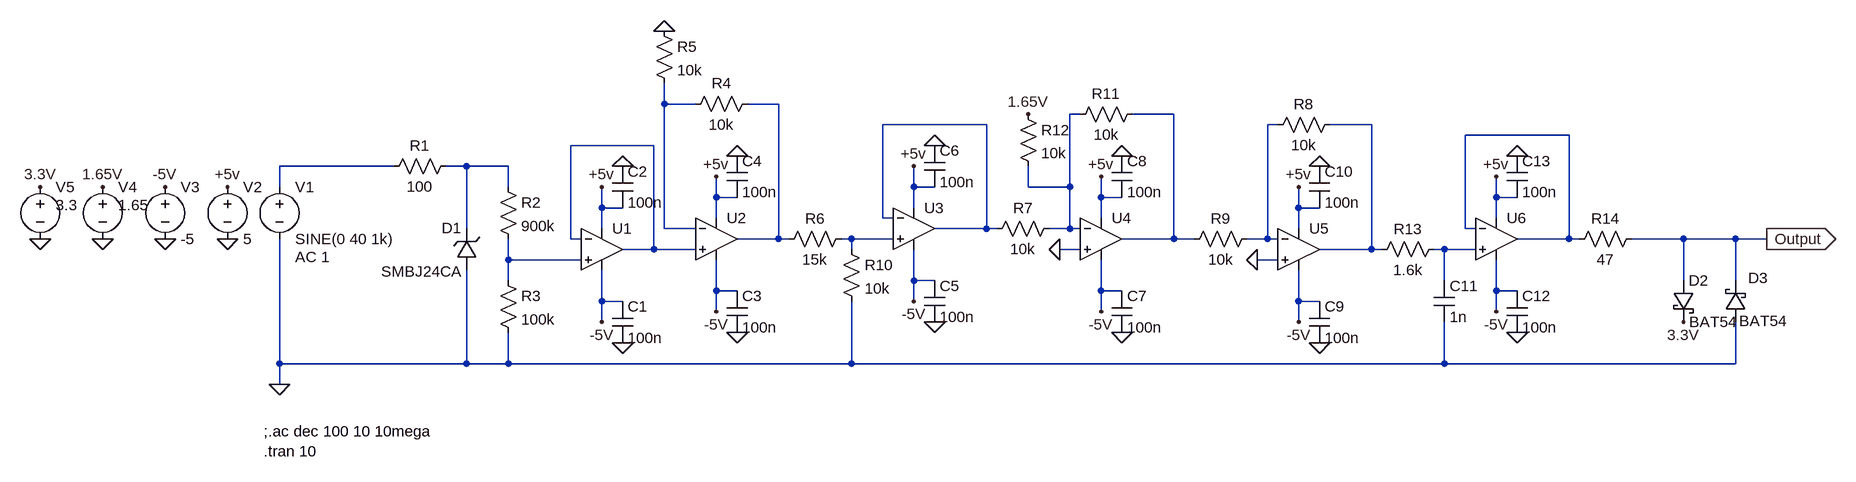
[diagram p0: schematic Osc_front.asc]
Osc_front.asc, the LTspice schematic file:
Version 4.1
SHEET 1 2380 712
WIRE 544 16 544 -16
WIRE 592 16 544 16
WIRE 720 16 672 16
WIRE 1184 32 1168 32
WIRE 1328 32 1264 32
WIRE 1040 48 880 48
WIRE 1488 48 1472 48
WIRE 1632 48 1568 48
WIRE 1936 64 1776 64
WIRE 528 80 400 80
WIRE 128 112 -48 112
WIRE 240 112 208 112
WIRE 304 112 240 112
WIRE -48 144 -48 112
WIRE 304 144 304 112
WIRE 928 144 928 112
WIRE 960 144 928 144
WIRE 1104 144 1104 112
WIRE 1168 144 1168 32
WIRE 1168 144 1104 144
WIRE 624 160 624 128
WIRE 656 160 624 160
WIRE 1216 160 1216 128
WIRE 1248 160 1216 160
WIRE 1824 160 1824 128
WIRE 1856 160 1824 160
WIRE 448 176 448 144
WIRE 480 176 448 176
WIRE 928 176 928 144
WIRE 1520 176 1520 144
WIRE 1552 176 1520 176
WIRE 624 192 624 160
WIRE 880 192 880 48
WIRE 896 192 880 192
WIRE 1216 192 1216 160
WIRE 1824 192 1824 160
WIRE 240 208 240 112
WIRE 448 208 448 176
WIRE 544 208 544 16
WIRE 592 208 544 208
WIRE 1040 208 1040 48
WIRE 1040 208 960 208
WIRE 1056 208 1040 208
WIRE 1168 208 1168 144
WIRE 1168 208 1136 208
WIRE 1184 208 1168 208
WIRE 1520 208 1520 176
WIRE 1776 208 1776 64
WIRE 1792 208 1776 208
WIRE 400 224 400 80
WIRE 416 224 400 224
WIRE 720 224 720 16
WIRE 720 224 656 224
WIRE 736 224 720 224
WIRE 832 224 816 224
WIRE 896 224 832 224
WIRE 1328 224 1328 32
WIRE 1328 224 1248 224
WIRE 1360 224 1328 224
WIRE 1472 224 1472 48
WIRE 1472 224 1440 224
WIRE 1488 224 1472 224
WIRE 1936 224 1936 64
WIRE 1936 224 1856 224
WIRE 1952 224 1936 224
WIRE 2112 224 2032 224
WIRE 2192 224 2112 224
WIRE 2240 224 2192 224
WIRE 528 240 528 80
WIRE 528 240 480 240
WIRE 592 240 528 240
WIRE 832 240 832 224
WIRE 1184 240 1152 240
WIRE 1632 240 1632 48
WIRE 1632 240 1552 240
WIRE 1648 240 1632 240
WIRE 1744 240 1728 240
WIRE 1792 240 1744 240
WIRE 304 256 304 224
WIRE 416 256 304 256
WIRE 1488 256 1456 256
WIRE 304 288 304 256
WIRE 928 288 928 240
WIRE 960 288 928 288
WIRE 1744 288 1744 240
WIRE 2112 288 2112 224
WIRE 2192 288 2192 224
WIRE 624 304 624 256
WIRE 656 304 624 304
WIRE 1216 304 1216 256
WIRE 1248 304 1216 304
WIRE 1824 304 1824 256
WIRE 1856 304 1824 304
WIRE 448 320 448 272
WIRE 480 320 448 320
WIRE 928 320 928 288
WIRE 1520 320 1520 272
WIRE 1552 320 1520 320
WIRE 624 336 624 304
WIRE 1216 336 1216 304
WIRE 1824 336 1824 304
WIRE 448 352 448 320
WIRE 1520 352 1520 320
WIRE -48 416 -48 224
WIRE 240 416 240 272
WIRE 240 416 -48 416
WIRE 304 416 304 368
WIRE 304 416 240 416
WIRE 832 416 832 320
WIRE 832 416 304 416
WIRE 1744 416 1744 352
WIRE 1744 416 832 416
WIRE 2192 416 2192 352
WIRE 2192 416 1744 416
WIRE -48 448 -48 416
FLAG -48 448 0
FLAG 448 144 +5v
FLAG 448 352 -5V
FLAG -128 144 +5v
FLAG -224 144 -5V
FLAG -128 224 0
FLAG -224 224 0
FLAG 544 -96 0
FLAG 480 384 0
FLAG 480 112 0
FLAG 624 128 +5v
FLAG 624 336 -5V
FLAG 656 368 0
FLAG 656 96 0
FLAG 928 112 +5v
FLAG 928 320 -5V
FLAG 960 352 0
FLAG 960 80 0
FLAG 1216 128 +5v
FLAG 1216 336 -5V
FLAG 1248 368 0
FLAG 1248 96 0
FLAG 1152 240 0
FLAG 1104 32 1.65V
FLAG -320 144 1.65V
FLAG -320 224 0
FLAG 1520 144 +5v
FLAG 1520 352 -5V
FLAG 1552 384 0
FLAG 1552 112 0
FLAG 1456 256 0
FLAG 1824 128 +5v
FLAG 1824 336 -5V
FLAG 1856 368 0
FLAG 1856 96 0
FLAG 2240 224 Output
IOPIN 2240 224 Out
FLAG -416 144 3.3V
FLAG -416 224 0
FLAG 2112 352 3.3V
SYMBOL res 224 96 R90
WINDOW 0 0 56 VBottom 2
WINDOW 3 32 56 VTop 2
SYMATTR InstName R1
SYMATTR Value 100
SYMATTR SpiceLine tol=1 pwr=0.1
SYMBOL voltage -48 128 R0
WINDOW 123 24 124 Left 2
WINDOW 39 0 0 Left 0
SYMATTR Value2 AC 1
SYMATTR InstName V1
SYMATTR Value SINE(0 40 1k)
SYMBOL TVSdiode 256 272 R180
WINDOW 0 24 65 Left 2
WINDOW 3 24 -2 Left 2
SYMATTR InstName D1
SYMATTR Value SMBJ24CA
SYMBOL res 288 128 R0
SYMATTR InstName R2
SYMATTR Value 900k
SYMBOL res 288 272 R0
SYMATTR InstName R3
SYMATTR Value 100k
SYMBOL voltage -128 128 R0
WINDOW 123 0 0 Left 0
WINDOW 39 0 0 Left 0
SYMATTR InstName V2
SYMATTR Value 5
SYMBOL voltage -224 128 R0
WINDOW 123 0 0 Left 0
WINDOW 39 0 0 Left 0
SYMATTR InstName V3
SYMATTR Value -5
SYMBOL OpAmps\\UniversalOpAmp 448 240 R0
SYMATTR InstName U1
SYMBOL res 688 0 R90
WINDOW 0 0 56 VBottom 2
WINDOW 3 32 56 VTop 2
SYMATTR InstName R4
SYMATTR Value 10k
SYMBOL res 528 -112 R0
SYMATTR InstName R5
SYMATTR Value 10k
SYMBOL cap 464 320 R0
SYMATTR InstName C1
SYMATTR Value 100n
SYMBOL cap 464 112 R0
SYMATTR InstName C2
SYMATTR Value 100n
SYMBOL OpAmps\\UniversalOpAmp 624 224 R0
SYMATTR InstName U2
SYMBOL cap 640 304 R0
SYMATTR InstName C3
SYMATTR Value 100n
SYMBOL cap 640 96 R0
SYMATTR InstName C4
SYMATTR Value 100n
SYMBOL voltage -320 128 R0
WINDOW 123 0 0 Left 0
WINDOW 39 0 0 Left 0
WINDOW 3 24 44 Left 2
SYMATTR Value 1.65
SYMATTR InstName V4
SYMBOL res 832 208 R90
WINDOW 0 0 56 VBottom 2
WINDOW 3 32 56 VTop 2
SYMATTR InstName R6
SYMATTR Value 15k
SYMBOL res 816 224 R0
SYMATTR InstName R10
SYMATTR Value 10k
SYMBOL OpAmps\\UniversalOpAmp 928 208 R0
SYMATTR InstName U3
SYMBOL cap 944 288 R0
SYMATTR InstName C5
SYMATTR Value 100n
SYMBOL cap 944 80 R0
SYMATTR InstName C6
SYMATTR Value 100n
SYMBOL OpAmps\\UniversalOpAmp 1216 224 R0
SYMATTR InstName U4
SYMBOL cap 1232 304 R0
SYMATTR InstName C7
SYMATTR Value 100n
SYMBOL cap 1232 96 R0
SYMATTR InstName C8
SYMATTR Value 100n
SYMBOL res 1280 16 R90
WINDOW 0 0 56 VBottom 2
WINDOW 3 32 56 VTop 2
SYMATTR InstName R11
SYMATTR Value 10k
SYMBOL res 1152 192 R90
WINDOW 0 0 56 VBottom 2
WINDOW 3 32 56 VTop 2
SYMATTR InstName R7
SYMATTR Value 10k
SYMBOL res 1088 16 R0
SYMATTR InstName R12
SYMATTR Value 10k
SYMBOL OpAmps\\UniversalOpAmp 1520 240 R0
SYMATTR InstName U5
SYMBOL cap 1536 320 R0
SYMATTR InstName C9
SYMATTR Value 100n
SYMBOL cap 1536 112 R0
SYMATTR InstName C10
SYMATTR Value 100n
SYMBOL res 1584 32 R90
WINDOW 0 0 56 VBottom 2
WINDOW 3 32 56 VTop 2
SYMATTR InstName R8
SYMATTR Value 10k
SYMBOL res 1456 208 R90
WINDOW 0 0 56 VBottom 2
WINDOW 3 32 56 VTop 2
SYMATTR InstName R9
SYMATTR Value 10k
SYMBOL res 1744 224 R90
WINDOW 0 0 56 VBottom 2
WINDOW 3 32 56 VTop 2
SYMATTR InstName R13
SYMATTR Value 1.6k
SYMBOL cap 1728 288 R0
SYMATTR InstName C11
SYMATTR Value 1n
SYMBOL OpAmps\\UniversalOpAmp 1824 224 R0
SYMATTR InstName U6
SYMBOL cap 1840 304 R0
SYMATTR InstName C12
SYMATTR Value 100n
SYMBOL cap 1840 96 R0
SYMATTR InstName C13
SYMATTR Value 100n
SYMBOL res 2048 208 R90
WINDOW 0 0 56 VBottom 2
WINDOW 3 32 56 VTop 2
SYMATTR InstName R14
SYMATTR Value 47
SYMBOL voltage -416 128 R0
WINDOW 123 0 0 Left 0
WINDOW 39 0 0 Left 0
WINDOW 3 24 44 Left 2
SYMATTR Value 3.3
SYMATTR InstName V5
SYMBOL schottky 2096 288 R0
WINDOW 3 25 64 Left 2
SYMATTR InstName D2
SYMATTR Value BAT54
SYMBOL schottky 2208 352 R180
WINDOW 0 -34 68 Left 2
WINDOW 3 -63 2 Left 2
SYMATTR InstName D3
SYMATTR Value BAT54
TEXT -72 520 Left 2 !;.ac dec 100 10 10mega\n.tran 10

The netlist it stands for:
* Osc_front.asc
R1 N011 N010 100 tol=1 pwr=0.1
V1 N010 0 SINE(0 40 1k) AC 1
D1 0 N011 SMBJ24CA
R2 N011 N014 900k
R3 N014 0 100k
V2 +5v 0 5
V3 -5V 0 -5
X§U1 N014 N009 +5v -5V N009 level1 Avol=1Meg GBW=10Meg Vos=0 En=0 Enk=0 In=0 Ink=0 Rin=500Meg  ; pins In+ In- V+ V- OUT
R4 N002 N001 10k
R5 0 N001 10k
C1 -5V 0 100n
C2 0 +5v 100n
X§U2 N009 N001 +5v -5V N002 level1 Avol=1Meg GBW=10Meg Vos=0 En=0 Enk=0 In=0 Ink=0 Rin=500Meg  ; pins In+ In- V+ V- OUT
C3 -5V 0 100n
C4 0 +5v 100n
V4 1.65V 0 1.65
R6 N012 N002 15k
R10 N012 0 10k
X§U3 N012 N005 +5v -5V N005 level1 Avol=1Meg GBW=10Meg Vos=0 En=0 Enk=0 In=0 Ink=0 Rin=500Meg  ; pins In+ In- V+ V- OUT
C5 -5V 0 100n
C6 0 +5v 100n
X§U4 0 N003 +5v -5V N004 level1 Avol=1Meg GBW=10Meg Vos=0 En=0 Enk=0 In=0 Ink=0 Rin=500Meg  ; pins In+ In- V+ V- OUT
C7 -5V 0 100n
C8 0 +5v 100n
R11 N004 N003 10k
R7 N003 N005 10k
R12 1.65V N003 10k
X§U5 0 N006 +5v -5V N007 level1 Avol=1Meg GBW=10Meg Vos=0 En=0 Enk=0 In=0 Ink=0 Rin=500Meg  ; pins In+ In- V+ V- OUT
C9 -5V 0 100n
C10 0 +5v 100n
R8 N007 N006 10k
R9 N006 N004 10k
R13 N013 N007 1.6k
C11 N013 0 1n
X§U6 N013 N008 +5v -5V N008 level1 Avol=1Meg GBW=10Meg Vos=0 En=0 Enk=0 In=0 Ink=0 Rin=500Meg  ; pins In+ In- V+ V- OUT
C12 -5V 0 100n
C13 0 +5v 100n
R14 Output N008 47
V5 3.3V 0 3.3
D2 Output 3.3V BAT54
D3 0 Output BAT54
.model D D
.lib standard.dio
;.ac dec 100 10 10mega
.tran 10
.lib UniversalOpAmp1.lib
.backanno
.end